# EAGLE design STM32&PAP_board (EAGLE 8.4.1)
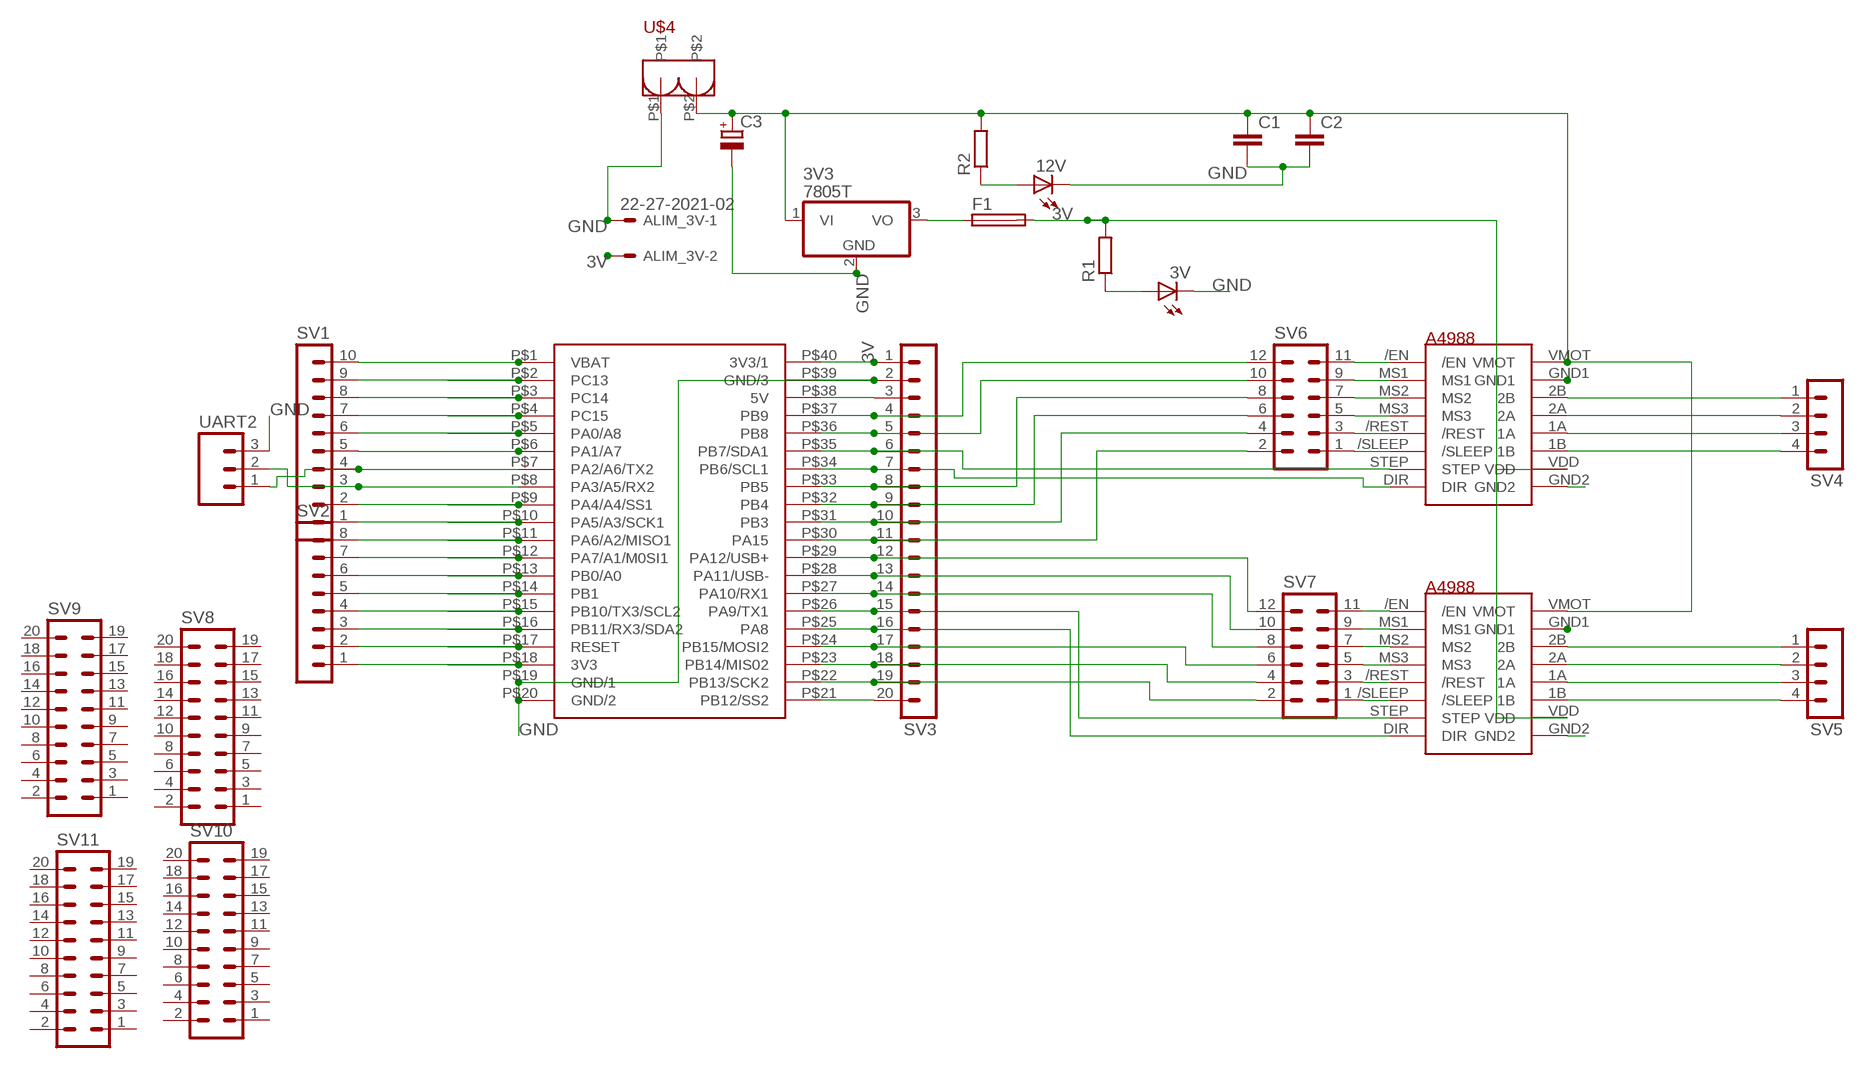
[diagram p0: schematic, sheet 1]

## Parts
3V  LED_ELD260  [LED_LD260]
3V3  7805T  [TO220H]
12V  LED_ELD260  [LED_LD260]
ALIM_3V  22-27-2021-02  [6410-02]
C1  C5/5  [C5B5]
C2  C5/5  [C5B5]
C3  CPOL-EUE5-13  [E5-13]
F1  TR5  [TR5]
R1  R0204/7  [0204/7]
R2  R0204/7  [0204/7]
SV1  MA10-1  [MA10-1]
SV2  MA08-1  [MA08-1]
SV3  MA20-1  [MA20-1]
SV4  MA04-1  [MA04-1]
SV5  MA04-1  [MA04-1]
SV6  MA06-2  [MA06-2]
SV7  MA06-2  [MA06-2]
SV8  MA10-2  [MA10-2]
SV9  MA10-2  [MA10-2]
SV10  MA10-2  [MA10-2]
SV11  MA10-2  [MA10-2]
U$1  POLOLU_A4988_MOTOR_DRIVER  [POLOLU_A4988_MOTOR_DRIVER]
U$2  POLOLU_A4988_MOTOR_DRIVER  [POLOLU_A4988_MOTOR_DRIVER]
U$3  BLUEPILL  [BLUEPILL]
U$4  GREEN_HEADER  [GREEN_HEADER]
UART2  MA03  [03P]

## Nets
3V: ALIM_3V.2 F1.2 R1.2 SV3.1 U$1.VDD U$2.VDD U$3.P$40(3V3/1)
GND: 3V3.2(GND) 3V.K(C) 12V.K(C) ALIM_3V.1 C1.2 C2.2 C3.- SV3.2 U$3.P$19(GND/1) U$3.P$20(GND/2) U$3.P$39(GND/3) U$4.P$1 UART2.3
N$1: SV5.1 U$2.2B
N$2: SV5.2 U$2.2A
N$3: SV2.1 U$3.P$18(3V3)
N$4: SV2.2 U$3.P$17(RESET)
N$5: SV2.3 U$3.P$16(PB11/RX3/SDA2)
N$6: SV2.4 U$3.P$15(PB10/TX3/SCL2)
N$7: SV2.5 U$3.P$14(PB1)
N$8: SV2.6 U$3.P$13(PB0/A0)
N$9: SV2.7 U$3.P$12(PA7/A1/M0SI1)
N$10: SV2.8 U$3.P$11(PA6/A2/MISO1)
N$11: SV1.1 U$3.P$10(PA5/A3/SCK1)
N$12: SV1.2 U$3.P$9(PA4/A4/SS1)
N$13: SV1.3 U$3.P$8(PA3/A5/RX2) UART2.2
N$14: SV1.4 U$3.P$7(PA2/A6/TX2) UART2.1
N$15: SV1.5 U$3.P$6(PA1/A7)
N$16: SV1.6 U$3.P$5(PA0/A8)
N$17: SV1.7 U$3.P$4(PC15)
N$18: SV1.8 U$3.P$3(PC14)
N$19: SV1.9 U$3.P$2(PC13)
N$20: SV1.10 U$3.P$1(VBAT)
N$21: SV6.1 U$1./SLEEP
N$22: SV5.3 U$2.1A
N$23: SV3.3 U$3.P$38(5V)
N$24: SV3.4 SV6.12 U$3.P$37(PB9)
N$25: SV3.5 SV6.10 U$3.P$36(PB8)
N$26: U$1.GND2
N$27: SV3.7 U$1.DIR U$3.P$34(PB6/SCL1)
N$28: U$2.GND2
N$29: SV3.9 SV6.6 U$3.P$32(PB4)
N$30: SV3.10 SV6.4 U$3.P$31(PB3)
N$31: SV3.11 SV6.2 U$3.P$30(PA15)
N$32: SV3.12 SV7.12 U$3.P$29(PA12/USB+)
N$33: SV3.13 SV7.10 U$3.P$28(PA11/USB-)
N$34: SV3.14 SV7.8 U$3.P$27(PA10/RX1)
N$35: SV3.15 U$2.STEP U$3.P$26(PA9/TX1)
N$36: SV3.16 U$2.DIR U$3.P$25(PA8)
N$37: SV3.17 SV7.6 U$3.P$24(PB15/MOSI2)
N$38: SV3.18 SV7.4 U$3.P$23(PB14/MIS02)
N$39: SV3.19 SV7.2 U$3.P$22(PB13/SCK2)
N$40: SV3.20 U$3.P$21(PB12/SS2)
N$41: 3V3.3(VO) F1.1
N$42: 3V3.1(VI) C1.1 C2.1 C3.+ R2.2 U$1.VMOT U$2.VMOT U$4.P$2
N$43: 3V.A R1.1
N$44: SV5.4 U$2.1B
N$45: U$1.GND1
N$46: U$2.GND1
N$47: 12V.A R2.1
N$49: SV4.1 U$1.2B
N$50: SV4.2 U$1.2A
N$51: SV4.3 U$1.1A
N$52: SV4.4 U$1.1B
N$53: SV6.3 U$1./REST
N$54: SV6.5 U$1.MS3
N$55: SV6.7 U$1.MS2
N$56: SV6.9 U$1.MS1
N$57: SV6.11 U$1./EN
N$58: SV3.6 U$1.STEP U$3.P$35(PB7/SDA1)
N$60: SV3.8 SV6.8 U$3.P$33(PB5)
N$61: SV7.11 U$2./EN
N$62: SV7.9 U$2.MS1
N$63: SV7.7 U$2.MS2
N$64: SV7.5 U$2.MS3
N$65: SV7.3 U$2./REST
N$66: SV7.1 U$2./SLEEP
Unconnected: SV8.1 SV8.2 SV8.3 SV8.4 SV8.5 SV8.6 SV8.7 SV8.8 SV8.9 SV8.10 SV8.11 SV8.12 SV8.13 SV8.14 SV8.15 SV8.16 SV8.17 SV8.18 SV8.19 SV8.20 SV9.1 SV9.2 SV9.3 SV9.4 SV9.5 SV9.6 SV9.7 SV9.8 SV9.9 SV9.10 SV9.11 SV9.12 SV9.13 SV9.14 SV9.15 SV9.16 SV9.17 SV9.18 SV9.19 SV9.20 SV10.1 SV10.2 SV10.3 SV10.4 SV10.5 SV10.6 SV10.7 SV10.8 SV10.9 SV10.10 SV10.11 SV10.12 SV10.13 SV10.14 SV10.15 SV10.16 SV10.17 SV10.18 SV10.19 SV10.20 SV11.1 SV11.2 SV11.3 SV11.4 SV11.5 SV11.6 SV11.7 SV11.8 SV11.9 SV11.10 SV11.11 SV11.12 SV11.13 SV11.14 SV11.15 SV11.16 SV11.17 SV11.18 SV11.19 SV11.20

## Library data of the parts
3V 12V = eagle-ltspice:LED_E: LED Source: http://www.osram.convergy.de Source: www.luxeon.com Source: www.kingbright.com; SPICEMODEL: NONE; SPICEPREFIX: D; SPICETYPE: diode
3V3 = linear:78*: Positive VOLTAGE REGULATOR Source: http://cache.national.com/ds/LM/LM78L05.pdf http://www.fairchildsemi.com/ds/LM/LM7805.pdf
ALIM_3V = con-molex:22-?-02: CONNECTOR wire to board 2.54 mm (.1 inch) pitch header; OC_FARNELL: unknown; OC_NEWARK: unknown
C1 C2 = capacitor-wima:C: CAPACITOR naming: grid - package width
C3 = rcl:CPOL-EU: POLARIZED CAPACITOR, European symbol
F1 = fuse:TR5: FUSE Wickmann; OC_FARNELL: unknown; OC_NEWARK: unknown
R1 R2 = eagle-ltspice:R: RESISTOR, European symbol; SPICEMODEL: NONE; SPICEPREFIX: R
SV1 = con-lstb:MA10-1: PIN HEADER; OC_FARNELL: unknown; OC_NEWARK: unknown
SV2 = con-lstb:MA08-1: PIN HEADER; OC_FARNELL: unknown; OC_NEWARK: unknown
SV3 = con-lstb:MA20-1: PIN HEADER; OC_FARNELL: unknown; OC_NEWARK: unknown
SV4 SV5 = con-lstb:MA04-1: PIN HEADER; OC_FARNELL: unknown; OC_NEWARK: unknown
SV6 SV7 = con-lstb:MA06-2: PIN HEADER; OC_FARNELL: unknown; OC_NEWARK: unknown
SV8-SV11 = con-lstb:MA10-2: PIN HEADER; OC_FARNELL: unknown; OC_NEWARK: unknown
U$1 U$2 = POLOLU_A4988_MOTOR_DRIVER:POLOLU_A4988_MOTOR_DRIVER: A4988 Stepper Motor Driver Carrier Pitch : 2.54mm //FCAM1//
U$3 = stm32duino boards:BLUEPILL
U$4 = PowerHeaders:GREEN_HEADER: Green Connector for PCB Drill: 1.5mm Diameter: 3.81mm Pitch: 5.08mm //FCAM1
UART2 = con-amp-quick:MA03: AMP QUICK CONNECTOR; OC_FARNELL: unknown; OC_NEWARK: unknown

## Board
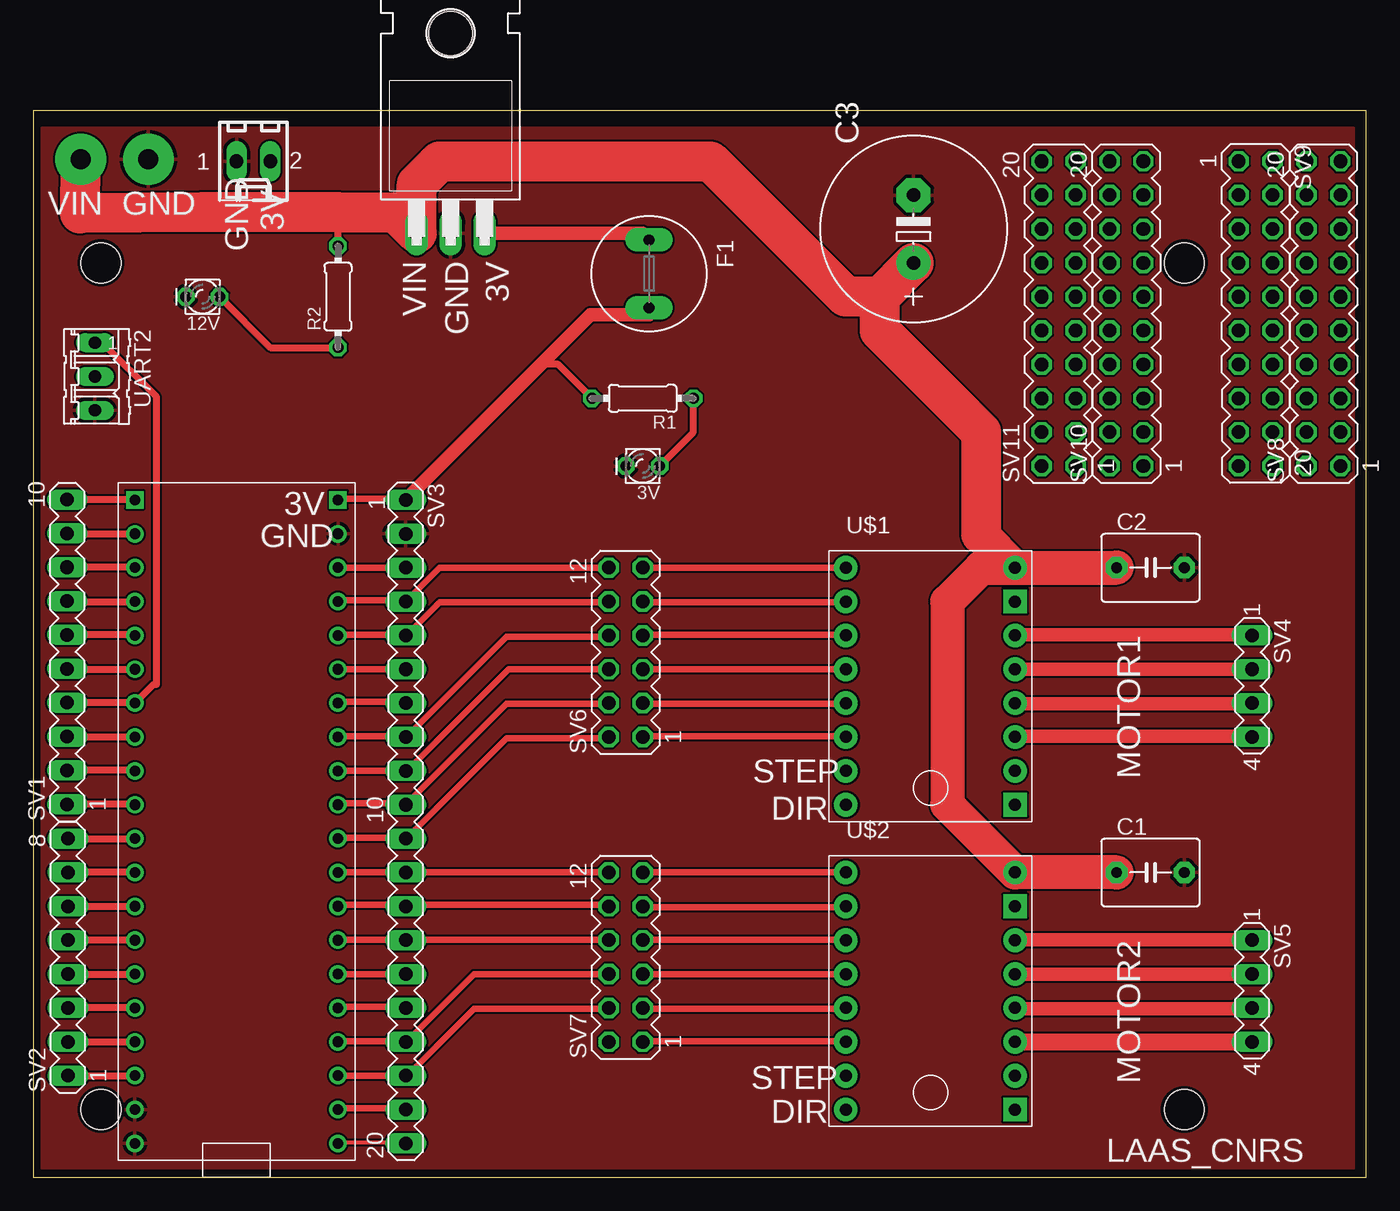
[diagram p1: board, top side]
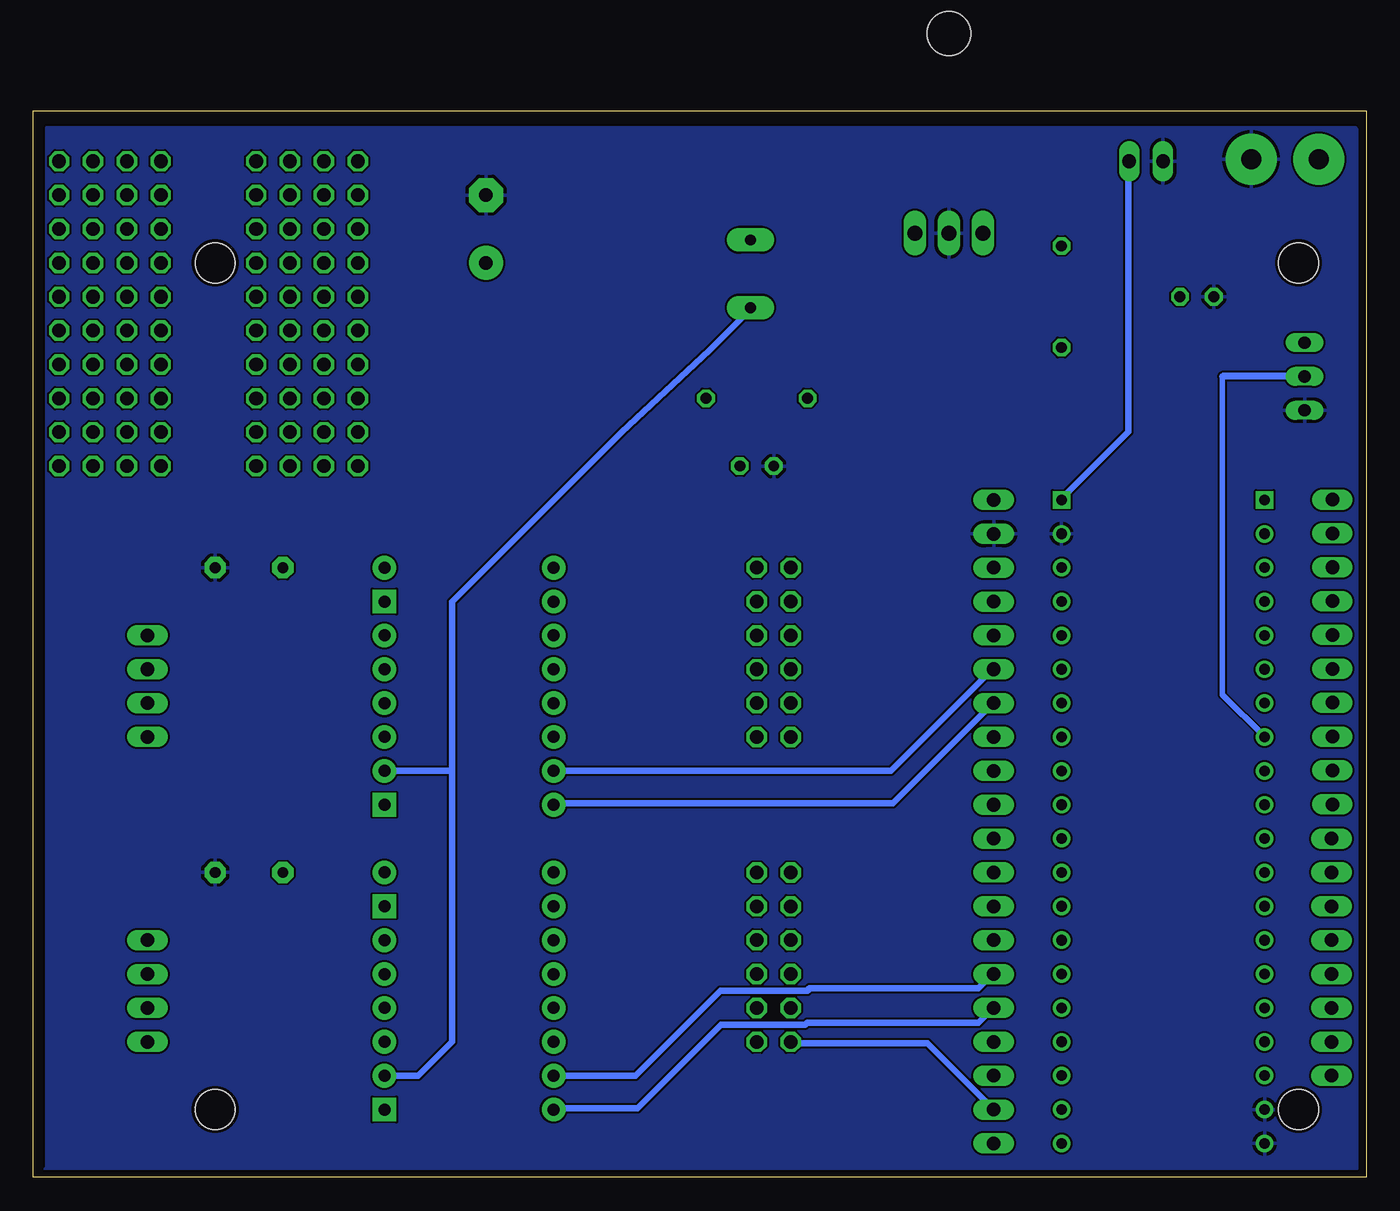
[diagram p2: board, bottom side, seen from below]

Size 100 x 80 mm. Coordinates in mm from the lower left corner, seen from the top.
Outline: 0,0 100,0 100,80 0,80 0,0
Copper layers (1*16): Top 0.035mm / dielectric 1.5mm / Bottom 0.035mm
Design rules "SeeedStudio_2layer_DRU_no_angle_20140221": minimum track width 6mil, minimum drill 12mil, track to track 6mil, track to pad 6mil, pad to pad 6mil, via to via 6mil, smd to smd 0mil, copper to edge 10mil, drill to drill 10mil, minimum pad ring 10mil, minimum via ring 6mil, stop-mask expansion 2mil, vias tented up to drill 100mil, thermal gap 10mil

### Footprints (pad centres in the part's own frame; a part is rotated, then mirrored left to right if it is on the bottom)
LED_LD260 = drill 0.813 octagon: A -1.27,0; K 1.27,0
TO220H = drill 1.118 long: 1 -2.54,-10.16; 2 0,-10.16; 3 2.54,-10.16 | hole 3.302: 0,4.826
6410-02 = drill 1.016 long: 1 1.27,0; 2 -1.27,0
C5B5 = drill 0.813 pad 1.6 octagon: 1 -2.54,0; 2 2.54,0
E5-13 = drill 1.016 pad 2.54: + -2.54,0 | drill 1.016 pad 2.54 octagon: - 2.54,0
TR5 = drill 0.813 pad 1.778 long: 1 -2.54,0; 2 2.54,0
0204/7 = drill 0.813 octagon: 1 -3.81,0; 2 3.81,0
MA10-1 = drill 1.016 long: 1 -11.43,0; 2 -8.89,0; 3 -6.35,0; 4 -3.81,0; 5 -1.27,0; 6 1.27,0; 7 3.81,0; 8 6.35,0; 9 8.89,0; 10 11.43,0
MA08-1 = drill 1.016 long: 1 -8.89,0; 2 -6.35,0; 3 -3.81,0; 4 -1.27,0; 5 1.27,0; 6 3.81,0; 7 6.35,0; 8 8.89,0
MA20-1 = drill 1.016 long: 1 -24.13,0; 2 -21.59,0; 3 -19.05,0; 4 -16.51,0; 5 -13.97,0; 6 -11.43,0; 7 -8.89,0; 8 -6.35,0; 9 -3.81,0; 10 -1.27,0; 11 1.27,0; 12 3.81,0; 13 6.35,0; 14 8.89,0; 15 11.43,0; 16 13.97,0; 17 16.51,0; 18 19.05,0; 19 21.59,0; 20 24.13,0
MA04-1 = drill 1.016 long: 1 -3.81,0; 2 -1.27,0; 3 1.27,0; 4 3.81,0
MA06-2 = drill 1.016 octagon: 1 -6.35,-1.27; 2 -6.35,1.27; 3 -3.81,-1.27; 4 -3.81,1.27; 5 -1.27,-1.27; 6 -1.27,1.27; 7 1.27,-1.27; 8 1.27,1.27; 9 3.81,-1.27; 10 3.81,1.27; 11 6.35,-1.27; 12 6.35,1.27
MA10-2 = drill 1.016 octagon: 1 -11.43,-1.27; 2 -11.43,1.27; 3 -8.89,-1.27; 4 -8.89,1.27; 5 -6.35,-1.27; 6 -6.35,1.27; 7 -3.81,-1.27; 8 -3.81,1.27; 9 -1.27,-1.27; 10 -1.27,1.27; 11 1.27,-1.27; 12 1.27,1.27; 13 3.81,-1.27; 14 3.81,1.27; 15 6.35,-1.27; 16 6.35,1.27; 17 8.89,-1.27; 18 8.89,1.27; 19 11.43,-1.27; 20 11.43,1.27
POLOLU_A4988_MOTOR_DRIVER = drill 0.9 pad 1.778: 1A 6.35,-1.27; 1B 6.35,-3.81; 2A 6.35,1.27; 2B 6.35,3.81; /EN -6.35,8.89; /REST -6.35,-1.27; /SLEEP -6.35,-3.81; DIR -6.35,-8.89; MS1 -6.35,6.35; MS2 -6.35,3.81; MS3 -6.35,1.27; STEP -6.35,-6.35; VDD 6.35,-6.35; VMOT 6.35,8.89 | drill 0.9 pad 1.778 square: GND1 6.35,-8.89; GND2 6.35,6.35
BLUEPILL = drill 0.8 square: P$1 -7.62,22.86; P$40 7.62,22.86 | drill 0.8: P$2 -7.62,20.32; P$3 -7.62,17.78; P$4 -7.62,15.24; P$5 -7.62,12.7; P$6 -7.62,10.16; P$7 -7.62,7.62; P$8 -7.62,5.08; P$9 -7.62,2.54; P$10 -7.62,0; P$11 -7.62,-2.54; P$12 -7.62,-5.08; P$13 -7.62,-7.62; P$14 -7.62,-10.16; P$15 -7.62,-12.7; P$16 -7.62,-15.24; P$17 -7.62,-17.78; P$18 -7.62,-20.32; P$19 -7.62,-22.86; P$20 -7.62,-25.4; P$21 7.62,-25.4; P$22 7.62,-22.86; P$23 7.62,-20.32; P$24 7.62,-17.78; P$25 7.62,-15.24; P$26 7.62,-12.7; P$27 7.62,-10.16; P$28 7.62,-7.62; P$29 7.62,-5.08; P$30 7.62,-2.54; P$31 7.62,0; P$32 7.62,2.54; P$33 7.62,5.08; P$34 7.62,7.62; P$35 7.62,10.16; P$36 7.62,12.7; P$37 7.62,15.24; P$38 7.62,17.78; P$39 7.62,20.32
GREEN_HEADER = drill 1.5 pad 3.81: P$1 -2.54,0; P$2 2.54,0
TROUS_FIXATION = hole 3: 5.08,5.08; 5.08,68.58; 86.36,68.58; 86.36,5.08
03P = drill 0.914 long: 1 -2.54,0; 2 0,0; 3 2.54,0

### Placement (x,y rotation side)
3V  45.72,53.34 180 top
3V3  31.31,80.97 0 top
12V  12.7,66.04 180 top
ALIM_3V  16.51,76.2 180 top
C1  83.82,22.86 0 top
C2  83.82,45.72 0 top
C3  66.04,71.12 90 top
F1  46.2,67.76 270 top
R1  45.72,58.42 180 top
R2  22.86,66.04 90 top
SV1  2.54,39.4 90 top
SV2  2.59,16.51 90 top
SV3  27.94,26.67 270 top
SV4  91.44,36.83 270 top
SV5  91.44,13.97 270 top
SV6  44.45,39.37 90 top
SV7  44.45,16.51 90 top
SV8  96.79,64.77 90 top
SV9  91.71,64.77 270 top
SV10  82.01,64.77 90 top
SV11  76.93,64.77 90 top
U$1  67.31,36.83 0 top
U$2  67.31,13.97 0 top
U$3  15.24,27.94 0 top
U$4  6.09,76.36 180 top
U$5  [TROUS_FIXATION]  0,0 0 top
UART2  4.62,60.06 270 top

### Tracks (layer width: path | path; a pad name or v marks a point on that pad's centre or on a via)
3V
  Top 0.152: 22.86,50.9 U$3.P$40 | 27.89,50.9 SV3.1
  Top 0.5: 27.89,50.9 22.86,50.9 | 46.2,64.68 F1.2
  Top 0.508: R1.2 39.37,60.96 38.1,60.96
  Top 1.016: SV3.1 38.1,60.96 41.82,64.68 46.2,64.68
  Bottom 0.152: 17.83,76.2 ALIM_3V.2 | 22.86,50.9 U$3.P$40
  Bottom 0.5: 17.83,76.2 17.83,55.93 22.86,50.9 | U$2.VDD 71.12,7.62 68.58,10.16 68.58,30.48 | 68.58,30.48 68.58,43.18 55.88,55.88 49.28,62.04 46.2,65.12 F1.2 | U$1.VDD 68.58,30.48
GND
  pour Bottom: 0.76,78.74 99.06,78.74 99.06,0.76 99.19,0.64 0.64,0.64 0.64,78.61
  pour Top: 0.64,78.74 99.06,78.74 99.06,0.64 0.64,0.64
N$1
  Top 0.152: 73.76,17.83 U$2.2B | 91.44,17.83 SV5.1
  Top 1.016: 91.44,17.83 73.76,17.83
N$2
  Top 1.016: SV5.2 U$2.2A
N$3
  Top 0.508: SV2.1 U$3.P$18
N$4
  Top 0.152: U$3.P$17 7.62,10.21
  Top 0.508: SV2.2 U$3.P$17
N$5
  Top 0.152: 7.62,12.8 U$3.P$16
  Top 0.508: U$3.P$16 SV2.3
N$6
  Top 0.508: SV2.4 U$3.P$15
N$7
  Top 0.152: 7.62,17.83 U$3.P$14
  Top 0.508: U$3.P$14 SV2.5
N$8
  Top 0.152: U$3.P$13 7.62,20.42
  Top 0.508: SV2.6 U$3.P$13
N$9
  Top 0.508: U$3.P$12 SV2.7
N$10
  Top 0.152: U$3.P$11 7.62,25.45
  Top 0.508: SV2.8 U$3.P$11
N$11
  Top 0.152: 7.62,28.04 U$3.P$10
  Top 0.508: U$3.P$10 7.59,27.97 SV1.1
N$12
  Top 0.508: U$3.P$9 7.59,30.51 SV1.2
N$13
  Top 0.152: U$3.P$8 7.62,33.07
  Top 0.508: SV1.3 2.57,33.02 U$3.P$8
  Bottom 0.406: 10.78,60.06 10.78,36.18 U$3.P$8
  Bottom 0.508: UART2.2 10.78,60.06
N$14
  Top 0.152: 7.62,35.66 U$3.P$7
  Top 0.508: UART2.1 5.16,62.6 9.24,58.52 9.24,36.96 9.02,36.96 U$3.P$7 7.59,35.59 SV1.4
N$15
  Top 0.508: SV1.5 2.57,38.1 U$3.P$6
N$16
  Top 0.152: 7.62,40.69 U$3.P$5
  Top 0.508: U$3.P$5 7.59,40.67 SV1.6
N$17
  Top 0.152: U$3.P$4 7.62,43.28
  Top 0.508: SV1.7 2.57,43.18 U$3.P$4
N$18
  Top 0.508: U$3.P$3 7.59,45.75 SV1.8
N$19
  Top 0.152: U$3.P$2 7.62,48.31
  Top 0.508: SV1.9 2.57,48.26 U$3.P$2
N$20
  Top 0.508: U$3.P$1 7.59,50.83 SV1.10
N$21
  Top 0.152: 60.96,33.07 U$1./SLEEP | 45.72,33.07 SV6.1
  Top 0.5: 45.72,33.07 60.96,33.07
N$22
  Top 0.152: 73.76,12.65 U$2.1A | 91.44,12.65 SV5.3
  Top 1.016: 91.44,12.65 73.76,12.65
N$23
  Top 0.5: SV3.3 U$3.P$38
N$24
  Top 0.152: 22.86,43.28 U$3.P$37 | 27.89,43.28 SV3.4
  Top 0.5: 27.89,43.28 22.86,43.28 | SV6.12 30.48,45.72 SV3.4
N$25
  Top 0.152: 22.86,40.69 U$3.P$36 | 27.89,40.69 SV3.5 28.04,40.69 | 43.13,43.13 SV6.10
  Top 0.5: 27.89,40.69 22.86,40.69 | 43.13,43.13 30.48,43.13 28.04,40.69
N$27
  Top 0.152: 22.86,35.66 U$3.P$34 | 27.89,35.66 SV3.7
  Top 0.5: 27.89,35.66 22.86,35.66
  Bottom 0.152: 60.96,28.04 U$1.DIR | 28.04,35.51 SV3.7
  Bottom 0.5: 60.96,28.04 35.51,28.04 28.04,35.51
N$29
  Top 0.152: 28.04,30.48 SV3.9
  Top 0.5: SV3.9 U$3.P$32 | SV6.6 35.66,38.1 28.04,30.48
N$30
  Top 0.152: 22.86,28.04 U$3.P$31 | 27.89,28.04 SV3.10 | 43.13,35.51 SV6.4
  Top 0.5: 27.89,28.04 22.86,28.04 | 43.13,35.51 35.51,35.51 SV3.10
N$31
  Top 0.152: 22.86,25.45 U$3.P$30 | 27.89,25.45 SV3.11 28.04,25.45 | 43.13,32.92 SV6.2
  Top 0.5: 27.89,25.45 22.86,25.45 | 43.13,32.92 35.51,32.92 28.04,25.45
N$32
  Top 0.5: U$3.P$29 SV3.12 SV7.12
N$33
  Top 0.152: 22.86,20.42 U$3.P$28 | 27.89,20.42 SV3.13 28.04,20.42 | 43.13,20.42 SV7.10
  Top 0.5: 27.89,20.42 22.86,20.42 | 28.04,20.42 43.13,20.42
N$34
  Top 0.152: 22.86,17.83 U$3.P$27 | 27.89,17.83 SV3.14 28.04,17.83 | 43.13,17.83 SV7.8
  Top 0.5: 27.89,17.83 22.86,17.83 | 28.04,17.83 43.13,17.83
N$35
  Top 0.5: SV3.15 U$3.P$26
  Bottom 0.152: 28.04,15.24 SV3.15
  Bottom 0.5: U$2.STEP 54.81,7.62 48.44,13.99 41.93,13.99 41.75,14.17 29.11,14.17 28.04,15.24
N$36
  Top 0.152: 22.86,12.8 U$3.P$25 | 27.89,12.8 SV3.16
  Top 0.5: 27.89,12.8 22.86,12.8
  Bottom 0.152: 60.96,5.18 U$2.DIR | 28.04,12.65 SV3.16
  Bottom 0.5: 60.96,5.18 54.66,5.18 48.42,11.42 42.1,11.42 41.94,11.58 29.11,11.58 28.04,12.65
N$37
  Top 0.152: 22.86,10.21 U$3.P$24 | 27.89,10.21 SV3.17 28.04,10.21
  Top 0.5: 27.89,10.21 22.86,10.21 | SV7.6 33.07,15.24 28.04,10.21
N$38
  Top 0.152: 43.13,12.65 SV7.4 | 28.04,7.62 SV3.18
  Top 0.5: SV3.18 U$3.P$23 | 43.13,12.65 33.07,12.65 28.04,7.62
N$39
  Top 0.152: 22.86,5.18 U$3.P$22 | 27.89,5.18 SV3.19
  Top 0.5: 27.89,5.18 22.86,5.18
  Bottom 0.152: 43.13,10.06 SV7.2
  Bottom 0.5: 43.13,10.06 32.92,10.06 SV3.19
N$40
  Top 0.152: 22.86,2.59 U$3.P$21 | 27.89,2.59 SV3.20
  Top 0.3: 27.89,2.59 22.86,2.59
N$41
  Top 0.508: 45.69,70.81 F1.1
  Top 1.016: 3V3.3 45.69,70.81
N$42
  Top 0.508: R2.2 22.86,72.38
  Top 2.54: U$1.VMOT 71.12,45.72 68.58,43.18 68.58,27.94 U$2.VMOT C1.1 | U$1.VMOT C2.1 | 12.32,72.38 12.7,72.38 | U$1.VMOT 71.12,48.26
  Top 3: 63.5,66.04 60.96,66.04 50.8,76.2 30.48,76.2 28.77,74.49 3V3.1 27.2,72.38 22.86,72.38 12.7,72.38 3.51,72.3 U$4.P$2 | 63.5,66.04 C3.+ | 71.12,48.26 71.12,55.88 63.5,63.5 63.5,66.04
N$43
  Top 0.508: 3V.A 49.53,55.88 R1.1
N$44
  Top 0.152: 73.76,10.21 U$2.1B | SV5.4 91.44,10.21
  Top 1.27: U$2.1B SV5.4
N$47
  Top 0.508: 12V.A 17.78,62.23 R2.1
N$49
  Top 0.152: 73.76,40.69 U$1.2B | 91.44,40.69 SV4.1
  Top 1.016: 91.44,40.69 73.76,40.69
N$50
  Top 1.016: SV4.2 U$1.2A
N$51
  Top 0.152: 73.76,35.51 U$1.1A | 91.44,35.51 SV4.3
  Top 1.016: 91.44,35.51 73.76,35.51
N$52
  Top 0.152: 73.76,33.07 U$1.1B | 91.44,33.07 SV4.4
  Top 1.016: 91.44,33.07 73.76,33.07
N$53
  Top 0.152: 60.96,35.51 U$1./REST | 45.72,35.51 SV6.3
  Top 0.5: 45.72,35.51 60.96,35.51
N$54
  Top 0.5: SV6.5 U$1.MS3
N$55
  Top 0.152: 60.96,40.69 U$1.MS2 | 45.72,40.69 SV6.7
  Top 0.5: 45.72,40.69 60.96,40.69
N$56
  Top 0.152: 60.96,43.13 U$1.MS1 | 45.72,43.13 SV6.9
  Top 0.5: 45.72,43.13 60.96,43.13
N$57
  Top 0.5: SV6.11 U$1./EN
N$58
  Top 0.5: SV3.6 U$3.P$35
  Bottom 0.152: 28.04,38.1 SV3.6
  Bottom 0.5: U$1.STEP 35.66,30.48 28.04,38.1
N$60
  Top 0.152: 22.86,33.07 U$3.P$33 | 27.89,33.07 SV3.8 28.04,33.07 | 43.13,40.54 SV6.8
  Top 0.5: 27.89,33.07 22.86,33.07 | 43.13,40.54 35.51,40.54 28.04,33.07
N$61
  Top 0.5: SV7.11 U$2./EN
N$62
  Top 0.152: 60.96,20.27 U$2.MS1 | 45.72,20.27 SV7.9
  Top 0.5: 45.72,20.27 60.96,20.27
N$63
  Top 0.152: 60.96,17.83 U$2.MS2 | 45.72,17.83 SV7.7
  Top 0.5: 45.72,17.83 60.96,17.83
N$64
  Top 0.5: SV7.5 U$2.MS3
N$65
  Top 0.152: 60.96,12.65 U$2./REST | 45.72,12.65 SV7.3
  Top 0.5: 45.72,12.65 60.96,12.65
N$66
  Top 0.152: 60.96,10.21 U$2./SLEEP | 45.72,10.21 SV7.1
  Top 0.5: 45.72,10.21 60.96,10.21

### Text on the board
tNames: VIN | GND | 3V | GND | VIN | GND | 3V | 3V | GND | MOTOR1 | STEP | DIR | MOTOR2 | STEP | DIR | LAAS_CNRS
tValues: 3V_Fuse | Motor_Fuse